# Altium schematic sheet MIC4422_MSFTDRIVER.SchDoc
size B; Organization: Altium Limited; Address1: L3, 12a Rodborough Rd; Address2: Frenchs Forest; Address3: NSW; Address4: Australia 2086; SheetNumber: 1; SheetTotal: 1
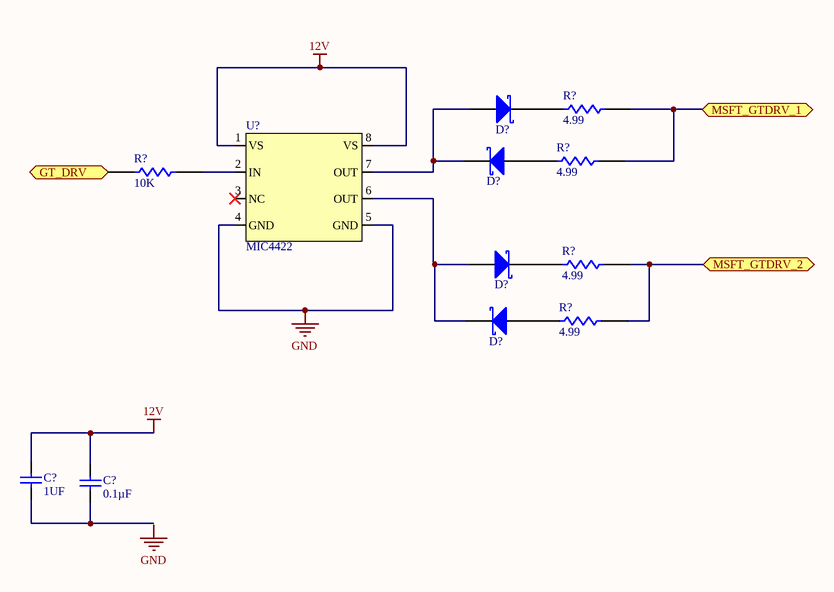
[diagram p0: MIC4422_MSFTDRIVER.SchDoc]

## Parts
(Parts that share a designator on the sheet are numbered #1, #2 ... from top to bottom, then left to right.)
C?#1  Capacitance: 1UF  [CAP0805_NEW]  (hidden comment: CC0805JKX7R9BB105)
C?#2  Capacitance: 0.1µF  [CAP0805_NEW]  (hidden comment: C0805C104J5RACAUTO)
D?#1  DB2W40300L  [Mini2-F3-B]  (value not drawn)
D?#2  DB2W40300L  [Mini2-F3-B]  (value not drawn)
D?#3  DB2W40300L  [Mini2-F3-B]  (value not drawn)
D?#4  DB2W40300L  [Mini2-F3-B]  (value not drawn)
R?#1  Resistance: 4.99  [RES0805]  (hidden comment: CRCW0805R4.99)
R?#2  Resistance: 4.99  [RES0805]  (hidden comment: CRCW0805R4.99)
R?#3  Resistance: 10K  [RES0805_New]  (hidden comment: TNPW080510K0FEEA)
R?#4  Resistance: 4.99  [RES0805]  (hidden comment: CRCW0805R4.99)
R?#5  Resistance: 4.99  [RES0805]  (hidden comment: CRCW0805R4.99)
U?  MIC4422  [SOIC127P600X163-8N]

## Ports
GT_DRV, MSFT_GTDRV_1, MSFT_GTDRV_2

## Nets
12V: C?#1.1 C?#2.2 U?.1(VS) U?.8(VS)
GND: U?.4(GND) U?.5(GND)
GT_DRV: R?#3.2 ; port GT_DRV
MSFT_GTDRV_1: R?#1.1 R?#2.1 ; port MSFT_GTDRV_1
MSFT_GTDRV_2: R?#4.1 R?#5.1 ; port MSFT_GTDRV_2
NetC?#1_2: C?#1.2 C?#2.1
NetD?#1_1: D?#1.1(K) R?#1.2
NetD?#1_3: D?#1.3(A) D?#2.1(K) U?.7(OUT)
NetD?#2_3: D?#2.3(A) R?#2.2
NetD?#3_1: D?#3.1(K) R?#4.2
NetD?#3_3: D?#3.3(A) D?#4.1(K) U?.6(OUT)
NetD?#4_3: D?#4.3(A) R?#5.2
NetR?#3_1: R?#3.1 U?.2(IN)

Not connected (* = marked no-connect by the designer): U? 3(NC)*

## Notes on the sheet
- Labels drawn without touching a wire or pin: GND
- Title:
- Size:
- B
- Document Number:
- Revision:
- Designer:
- Approval Date:
- Start Date:
- MM/DD/YY
- --/--/--
- Sheet:
- of
- Approver:
- CONFIDENTIAL
- Project Name/Number:

## Library data of the parts
C?#1 = CC0805JKX7R9BB105: CAP CER 1UF 50V X7R 0805; Manufacturer: Yageo; Tolerance: ±5%; Supplier 1: Digi-Key; Manufacturer Part Number: CC0805JKX7R9BB105; RoHS: RoHS Compliant; Category: Capacitors; Stock 1: 1863; Pricing 1: 1=0.34, 10=0.231, 100=0.131, 500=0.09248, 1000=0.08093 (USD); Packaging: Cut Tape (CT); Part Status: Active; Voltage - Rated: 50V; Temperature Coefficient: X7R; Operating Temperature: -55°C ~ 125°C; Features: -; Ratings: -; Applications: General Purpose; Failure Rate: -; Mounting Type: Surface Mount, MLCC; Package / Case: 0805 (2012 Metric); Size / Dimension: 0.079" L x 0.049" W (2.00mm x 1.25mm); Height - Seated (Max): -; Thickness (Max): 0.057" (1.45mm); Lead Spacing: -; Lead Style: -; ComponentLink1URL: http://www.yageo.com/documents/recent/UPY-GPHC_X7R_6.3V-to-50V_18.pdf; ComponentLink1Description: http://www.yageo.com/documents/recent/UPY-GPHC_X7R_6.3V-to-50V_18.pdf; Supplier Part Number 1: 311-3498-1-ND
C?#2 = C0805C104J5RACAUTO: CAP CER 0.1UF 50V X7R 0805; Manufacturer: KEMET; Tolerance: ±5%; Supplier 1: Digi-Key; Manufacturer Part Number: C0805C104J5RACAUTO; RoHS: RoHS Compliant; Category: Capacitors; Stock 1: 8605; Pricing 1: 1=0.22, 10=0.152, 100=0.0769, 500=0.05262, 1000=0.04655 (USD); Packaging: Cut Tape (CT); Part Status: Active; Voltage - Rated: 50V; Temperature Coefficient: X7R; Operating Temperature: -55°C ~ 125°C; Features: -; Ratings: AEC-Q200; Applications: Automotive; Failure Rate: -; Mounting Type: Surface Mount, MLCC; Package / Case: 0805 (2012 Metric); Size / Dimension: 0.079" L x 0.049" W (2.00mm x 1.25mm); Height - Seated (Max): -; Thickness (Max): 0.035" (0.88mm); Lead Spacing: -; Lead Style: -; ComponentLink1URL: http://www.kemet.com/docfinder?Partnumber=C0805C104J5RACAUTO; ComponentLink1Description: http://www.kemet.com/docfinder?Partnumber=C0805C104J5RACAUTO; Supplier Part Number 1: 399-6925-1-ND
D?#1-D?#4 = DB2W40300L: Manufacturer: Panasonic; Diode: DB24403
R?#3 = TNPW080510K0FEEA: RES 10K OHM 1% 1/5W 0805; Manufacturer: Vishay Dale; Power (Watts): 0.2W, 1/5W; Temperature Coefficient: ±25ppm/°C; Supplier 1: Digi-Key; Manufacturer Part Number: TNPW080510K0FEEA; RoHS: RoHS Compliant; Category: Resistors; Stock 1: 5000; Pricing 1: 1=0.42, 10=0.319, 100=0.134, 1000=0.07392, 2500=0.0693 (USD); Packaging: Cut Tape (CT); Part Status: Active; Tolerance: ±1%; Composition: Thin Film; Features: Anti-Sulfur, Automotive AEC-Q200, Moisture Resistant; Operating Temperature: -55°C ~ 155°C; Package / Case: 0805 (2012 Metric); Supplier Device Package: 0805; Size / Dimension: 0.079" L x 0.049" W (2.00mm x 1.25mm); Height - Seated (Max): 0.022" (0.55mm); Failure Rate: -; ComponentLink1URL: http://www.vishay.com/docs/28758/tnpw_e3.pdf; ComponentLink1Description: http://www.vishay.com/docs/28758/tnpw_e3.pdf; Supplier Part Number 1: 541-3915-1-ND
U? = MIC4422: Part number: MIC4422